# EAGLE board iMX233-OLinuXino-Micro_Rev_D (EAGLE 6.6.0), part 1 of 2
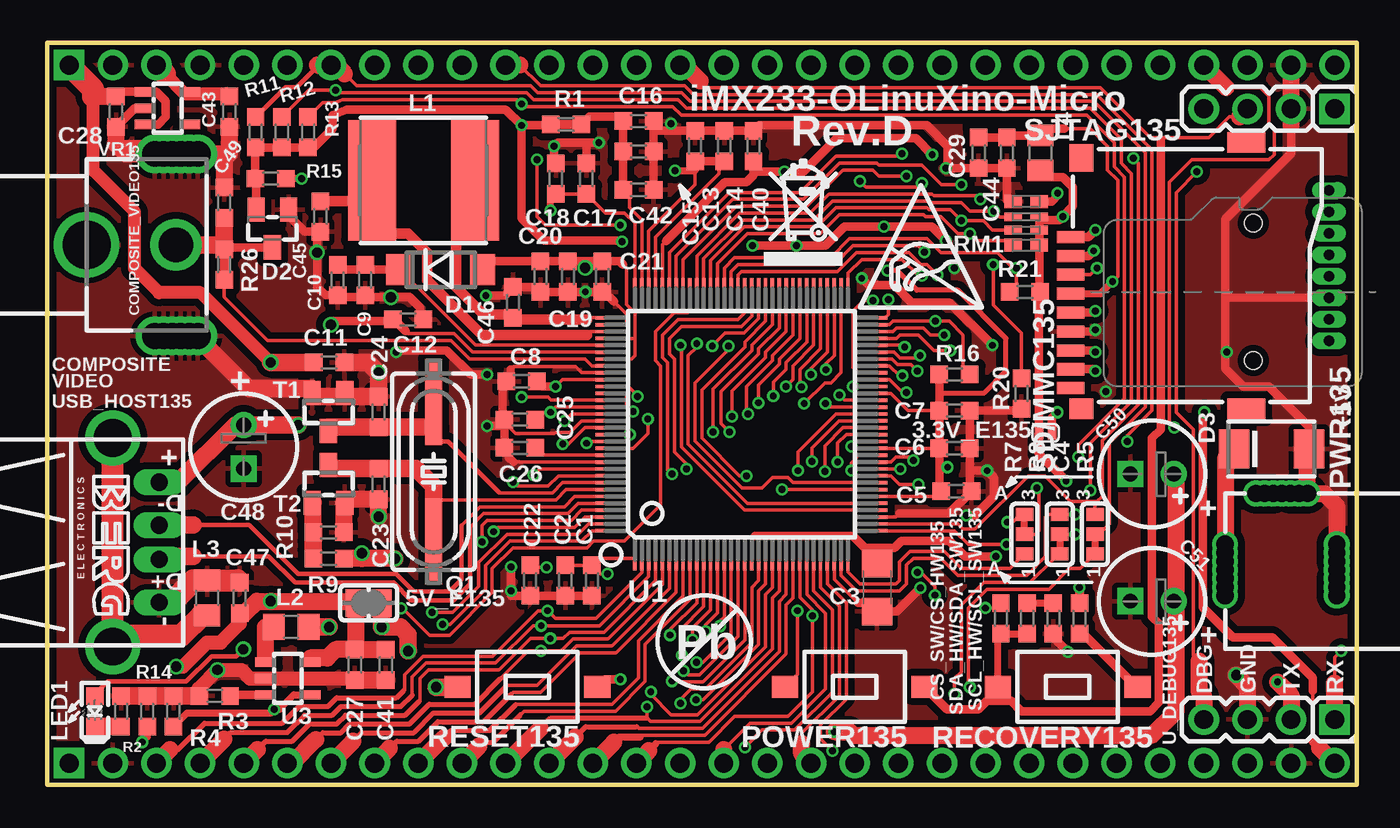
[diagram p2: board, top side]
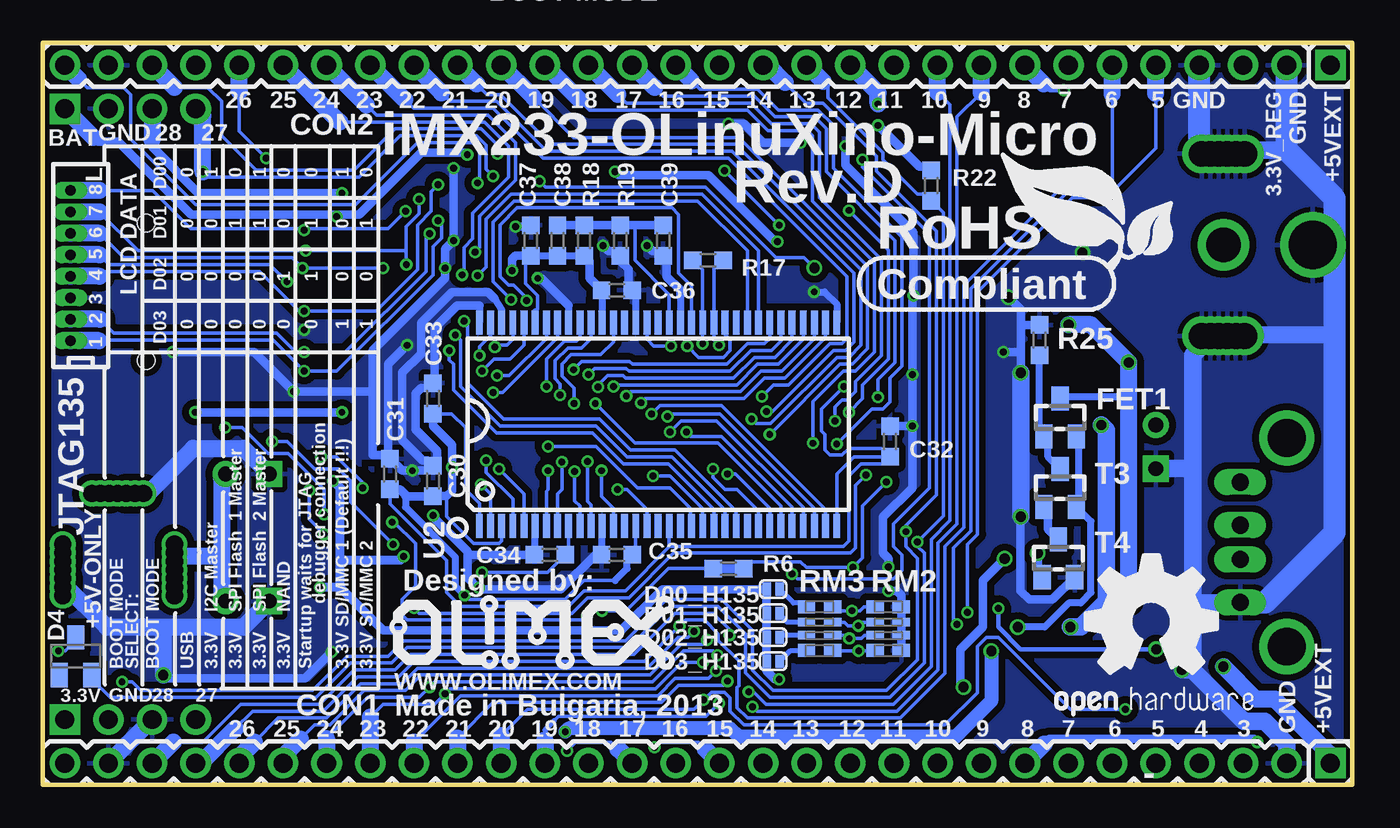
[diagram p3: board, bottom side, seen from below]

Size 76.2 x 43.2 mm. Coordinates in mm from the lower left corner, seen from the top.
Outline: 0,0 76.2,0 76.2,43.2 0,43.2 0,0
Copper layers (1+2*15+16): Top 0.035mm / dielectric 0.5mm / Route2 0.035mm / dielectric 0.5mm / Route15 0.035mm / dielectric 0.5mm / Bottom 0.035mm
Design rules "default": minimum track width 0.0051mm, minimum drill 0.3mm, track to track 0.15mm, track to pad 0.2mm, pad to pad 0.2mm, via to via 0.2mm, smd to smd 1mil, copper to edge 10mil, drill to drill 8mil, minimum pad ring 6mil, minimum via ring 0.15mm, stop-mask expansion 4mil, vias tented up to drill 25mil, thermal gap 12mil
Net classes: 1 PWR: width 0.203 mm, drill 0.4 mm, clearance 0.076 mm
tRestrict: 1 lines

## Footprints (pad centres in the part's own frame; a part is rotated, then mirrored left to right if it is on the bottom)
SJ_1_SMALLER = smd 0.508 x 0.762: 1 -0.381,0; 2 0.381,0
SJ-CLOSE = smd 1.168 x 1.6: 1 -0.762,0; 2 0.762,0
C0603_DWS = smd 1.016 x 1.016: 1 -0.889,0; 2 0.889,0
C1206 = smd 1.6 x 1.8: 1 -1.4,0; 2 1.4,0
E2,5-6,3 = drill 0.864 pad 1.524: + -1.27,0 | drill 0.864 pad 1.524 square: - 1.27,0
VIDEO_CINCH = drill 1.5 pad 1.93: GND1 -5.3,-5.475; GND1A -5.3,-3.975; GND1B -5.3,-4.475; GND1C -5.3,-4.975; GND1D -5.3,-5.975; GND1E -5.3,-6.475; GND3 5.3,-5.475; GND3C 5.3,-4.975; GND3D 5.3,-5.975; GND3E 5.3,-6.475; GNG3A 5.3,-3.975; GNG3B 5.3,-4.475 | drill 2.8: GND2 0,0 | drill 2: IO 0,-5.2
HN1X30 = drill 1.1 pad 1.778 square: 1 -36.83,0 | drill 1.1 pad 1.778: 2 -34.29,0; 3 -31.75,0; 4 -29.21,0; 5 -26.67,0; 6 -24.13,0; 7 -21.59,0; 8 -19.05,0; 9 -16.51,0; 10 -13.97,0; 11 -11.43,0; 12 -8.89,0; 13 -6.35,0; 14 -3.81,0; 15 -1.27,0; 16 1.27,0; 17 3.81,0; 18 6.35,0; 19 8.89,0; 20 11.43,0; 21 13.97,0; 22 16.51,0; 23 19.05,0; 24 21.59,0; 25 24.13,0; 26 26.67,0; 27 29.21,0; 28 31.75,0; 29 34.29,0; 30 36.83,0
SJ_2_SMALL = smd 0.762 x 1.016: 1 -1.143,0; 2 0,0; 3 1.143,0
MLL-41 = smd 1.45 x 1.8: A 2.445,0; K -2.445,0
SOT23C(BAT54S) = smd 1 x 1.4: 1 -0.95,-1.1; 2 0.95,-1.1; 3 0,1.1
DO214AA = smd 1.778 x 2.286: A 2.177,0; C -2.177,0
SOT23C = smd 1 x 1.4: 1 -0.95,-1.1; 2 0.95,-1.1; 3 0,1.1
SOT23 = smd 1 x 1.4: 1 -0.95,-1.1; 2 0.95,-1.1; 3 0,1.1
WU08S = drill 0.6 pad 0.991 long: 1 -4.375,0; 2 -3.125,0; 3 -1.875,0; 4 -0.625,0; 5 0.625,0; 6 1.875,0; 7 3.125,0; 8 4.375,0
L7078 = smd 2.8 x 7: 1 -3,0; 2 3,0
L0805_5MIL_DWS = smd 1.27 x 1.524: 1 -1.016,0; 2 1.016,0
LED-0603 = smd 1.016 x 1.016: A 0.889,0; C -0.889,0
SW-TAKT_6X3.5_SMD = smd 1.27 x 1.524: P$1 0,4.064; P$2 0,-4.064
PWR_JACK_UNI_MILLING = drill 1: + 0,4.75; +1 0,5.25; +2 0,5.75; +3 0,6.25; +4 0,4.25; +5 0,3.75; +6 0,3.25; - -6.5,4.75; -1 -6.5,5.25; -2 -6.5,5.75; -3 -6.5,4.25; -4 -6.5,3.75; -5 -6.5,6.25; -6 -6.5,3.25; -- -3.3,0.3; --1 -3.8,0.3; --2 -4.3,0.3; --3 -4.8,0.3; --4 -2.8,0.3; --5 -2.3,0.3; --6 -1.8,0.3
HC49/SMD2_THIN = smd 5 x 1: 1 -4.064,0; 2 4.064,0
0603_0R = smd 1.016 x 1.016: 1 -0.889,0; 2 0.889,0
R0603_5MIL_DWS = smd 1.016 x 1.016: 1 -0.889,0; 2 0.889,0
R_MATRIX_4 = smd 1.016 x 0.762: 1.1 -0.762,1.27; 1.2 0.762,1.27; 4.1 -0.762,-1.27; 4.2 0.762,-1.27 | smd 1.016 x 0.508: 2.1 -0.762,0.381; 2.2 0.762,0.381; 3.1 -0.762,-0.381; 3.2 0.762,-0.381
TFC-WPAPR-08 = smd 0.7 x 1.6: 1 -3.2,-0.125; 2 -2.1,-0.125; 3 -1,-0.125; 4 0.1,-0.125; 5 1.2,-0.125; 6 2.3,-0.125; 7 3.4,-0.125; 8 4.5,-0.125; 9 5.6,-0.125 | smd 1.2 x 1.4: 10 6.8,0.5 | smd 1.6 x 1.4: 11 -7.8,0.5 | smd 1.2 x 2.2: 12 6.8,10.1; 13 -8.7,10.1 | hole 1: 4,10.5; -4,10.5
HN1X4 = drill 1.1 pad 1.778 square: 1 -3.81,0 | drill 1.1 pad 1.778: 2 -1.27,0; 3 1.27,0; 4 3.81,0
SOT-23 = smd 1 x 1.4: 1 -0.95,-1.1; 2 0.95,-1.1; 3 0,1.1
TQFP128LD = smd 0.2 x 1.5: 1 -6.2,-7.75; 2 -5.8,-7.75; 3 -5.4,-7.75; 4 -5,-7.75; 5 -4.6,-7.75; 6 -4.2,-7.75; 7 -3.8,-7.75; 8 -3.4,-7.75; 9 -3,-7.75; 10 -2.6,-7.75; 11 -2.2,-7.75; 12 -1.8,-7.75; 13 -1.4,-7.75; 14 -1,-7.75; 15 -0.6,-7.75; 16 -0.2,-7.75; 17 0.2,-7.75; 18 0.6,-7.75; 19 1,-7.75; 20 1.4,-7.75; 21 1.8,-7.75; 22 2.2,-7.75; 23 2.6,-7.75; 24 3,-7.75; 25 3.4,-7.75; 26 3.8,-7.75; 27 4.2,-7.75; 28 4.6,-7.75; 29 5,-7.75; 30 5.4,-7.75; 31 5.8,-7.75; 32 6.2,-7.75; 65 6.2,7.75; 66 5.8,7.75; 67 5.4,7.75; 68 5,7.75; 69 4.6,7.75; 70 4.2,7.75; 71 3.8,7.75; 72 3.4,7.75; 73 3,7.75; 74 2.6,7.75; 75 2.2,7.75; 76 1.8,7.75; 77 1.4,7.75; 78 1,7.75; 79 0.6,7.75; 80 0.2,7.75; 81 -0.2,7.75; 82 -0.6,7.75; 83 -1,7.75; 84 -1.4,7.75; 85 -1.8,7.75; 86 -2.2,7.75; 87 -2.6,7.75; 88 -3,7.75; 89 -3.4,7.75; 90 -3.8,7.75; 91 -4.2,7.75; 92 -4.6,7.75; 93 -5,7.75; 94 -5.4,7.75; 95 -5.8,7.75; 96 -6.2,7.75 | smd 1.5 x 0.2: 33 7.75,-6.2; 34 7.75,-5.8; 35 7.75,-5.4; 36 7.75,-5; 37 7.75,-4.6; 38 7.75,-4.2; 39 7.75,-3.8; 40 7.75,-3.4; 41 7.75,-3; 42 7.75,-2.6; 43 7.75,-2.2; 44 7.75,-1.8; 45 7.75,-1.4; 46 7.75,-1; 47 7.75,-0.6; 48 7.75,-0.2; 49 7.75,0.2; 50 7.75,0.6; 51 7.75,1; 52 7.75,1.4; 53 7.75,1.8; 54 7.75,2.2; 55 7.75,2.6; 56 7.75,3; 57 7.75,3.4; 58 7.75,3.8; 59 7.75,4.2; 60 7.75,4.6; 61 7.75,5; 62 7.75,5.4; 63 7.75,5.8; 64 7.75,6.2; 97 -7.75,6.2; 98 -7.75,5.8; 99 -7.75,5.4; 100 -7.75,5; 101 -7.75,4.6; 102 -7.75,4.2; 103 -7.75,3.8; 104 -7.75,3.4; 105 -7.75,3; 106 -7.75,2.6; 107 -7.75,2.2; 108 -7.75,1.8; 109 -7.75,1.4; 110 -7.75,1; 111 -7.75,0.6; 112 -7.75,0.2; 113 -7.75,-0.2; 114 -7.75,-0.6; 115 -7.75,-1; 116 -7.75,-1.4; 117 -7.75,-1.8; 118 -7.75,-2.2; 119 -7.75,-2.6; 120 -7.75,-3; 121 -7.75,-3.4; 122 -7.75,-3.8; 123 -7.75,-4.2; 124 -7.75,-4.6; 125 -7.75,-5; 126 -7.75,-5.4; 127 -7.75,-5.8; 128 -7.75,-6.2
66TSOP-II = smd 0.4 x 1.4: 1 -10.4,-5.925; 2 -9.75,-5.925; 3 -9.1,-5.925; 4 -8.45,-5.925; 5 -7.8,-5.925; 6 -7.15,-5.925; 7 -6.5,-5.925; 8 -5.85,-5.925; 9 -5.2,-5.925; 10 -4.55,-5.925; 11 -3.9,-5.925; 12 -3.25,-5.925; 13 -2.6,-5.925; 14 -1.95,-5.925; 15 -1.3,-5.925; 16 -0.65,-5.925; 17 0,-5.925; 18 0.65,-5.925; 19 1.3,-5.925; 20 1.95,-5.925; 21 2.6,-5.925; 22 3.25,-5.925; 23 3.9,-5.925; 24 4.55,-5.925; 25 5.2,-5.925; 26 5.85,-5.925; 27 6.5,-5.925; 28 7.15,-5.925; 29 7.8,-5.925; 30 8.45,-5.925; 31 9.1,-5.925; 32 9.75,-5.925; 33 10.4,-5.925; 34 10.4,5.925; 35 9.75,5.925; 36 9.1,5.925; 37 8.45,5.925; 38 7.8,5.925; 39 7.15,5.925; 40 6.5,5.925; 41 5.85,5.925; 42 5.2,5.925; 43 4.55,5.925; 44 3.9,5.925; 45 3.25,5.925; 46 2.6,5.925; 47 1.95,5.925; 48 1.3,5.925; 49 0.65,5.925; 50 0,5.925; 51 -0.65,5.925; 52 -1.3,5.925; 53 -1.95,5.925; 54 -2.6,5.925; 55 -3.25,5.925; 56 -3.9,5.925; 57 -4.55,5.925; 58 -5.2,5.925; 59 -5.85,5.925; 60 -6.5,5.925; 61 -7.15,5.925; 62 -7.8,5.925; 63 -8.45,5.925; 64 -9.1,5.925; 65 -9.75,5.925; 66 -10.4,5.925
SOT23-5 = smd 0.55 x 1.2: 1 -0.95,-1.3; 2 0,-1.3; 3 0.95,-1.3; 4 0.95,1.3; 5 -0.95,1.3
USB_PN87520_HOST_PTH = drill 1 long: 1 -3.5,2.71; 2 -1,2.71; 3 1,2.71; 4 3.5,2.71 | drill 2.2: P$1 6.07,0; P$2 -6.07,0
SOT-23-5 = smd 0.55 x 1.2: 1 -0.95,-1.3; 2 0,-1.3; 3 0.95,-1.3; 4 0.95,1.3; 5 -0.95,1.3

## Placement (x,y rotation side)
3.3V_E135  Open  [SJ_1_SMALLER]  58.1,20.5 180 top
5V_E135  Close  [SJ-CLOSE]  18.7,10.6 180 top
C1  22uF/6.3V  [C0603_DWS]  31.7,11.9 90 top
C2  22uF/6.3V  [C0603_DWS]  30.15,11.9 90 top
C3  22uF/6.3V  [C1206]  48.3,11.5 90 top
C4  100nF  [C0603_DWS]  58.55,9.7 270 top
C5  4.7uF/6.3V  [C0603_DWS]  52.9,17.1 180 top
C6  100nF  [C0603_DWS]  52.8,19.6 180 top
C7  100nF  [C0603_DWS]  52.8,21.8 180 top
C8  4.7uF/6.3V  [C0603_DWS]  27.6,23.5 0 top
C9  22uF/6.3V  [C0603_DWS]  18.5,29.4 90 top
C10  22uF/6.3V  [C0603_DWS]  16.9,29.4 90 top
C11  22uF/6.3V  [C0603_DWS]  16.4,24.6 180 top
C12  100nF  [C0603_DWS]  21,27.1 180 top
C13  22uF/6.3V  [C0603_DWS]  37.7,37.2 270 top
C14  100nF  [C0603_DWS]  39.4,37.2 270 top
C15  22uF/6.3V  [C0603_DWS]  34.4,36.88 180 top
C16  100nF  [C0603_DWS]  34.4,38.65 180 top
C17  22uF/6.3V  [C0603_DWS]  31.38,35.3 270 top
C18  100nF  [C0603_DWS]  29.6,35.3 270 top
C19  22uF/6.3V  [C0603_DWS]  30.3,29.6 90 top
C20  22uF/6.3V  [C0603_DWS]  28.7,29.6 90 top
C21  22uF/6.3V  [C0603_DWS]  32.3,29.6 90 top
C22  100nF  [C0603_DWS]  28.1,11.9 90 top
C23  10pF  [C0603_DWS]  19.29,17.53 90 top
C24  10pF  [C0603_DWS]  19.29,21.72 270 top
C25  100nF  [C0603_DWS]  27.5,21.27 0 top
C26  1uF  [C0603_DWS]  27.5,19.62 0 top
C27  22uF/6.3V  [C0603_DWS]  17.9,7 270 top
C28  22uF/6.3V  [C0603_DWS]  4,39.2 270 top
C29  22uF/6.3V  [C0603_DWS]  54.2,36.8 90 top
C30  100nF  [C0603_DWS]  53.5,17.7 270 bottom
C31  100nF  [C0603_DWS]  56,18.1 270 bottom
C32  100nF  [C0603_DWS]  26.9,20 270 bottom
C33  100nF  [C0603_DWS]  53.5,22.5 270 bottom
C34  100nF  [C0603_DWS]  46.7,13.4 0 bottom
C35  100nF  [C0603_DWS]  42.8,13.4 0 bottom
C36  100nF  [C0603_DWS]  42.8,28.8 180 bottom
C37  100nF  [C0603_DWS]  47.8,31.7 270 bottom
C38  100nF  [C0603_DWS]  46.25,31.7 90 bottom
C39  100nF  [C0603_DWS]  40.1,31.7 90 bottom
C40  22uF/6.3V  [C0603_DWS]  41.1,37.2 270 top
C41  100nF  [C0603_DWS]  19.7,7 270 top
C42  22uF/6.3V  [C0603_DWS]  34.4,34.65 180 top
C43  22uF/6.3V  [C0603_DWS]  10.6,39.2 270 top
C44  22uF/6.3V  [C0603_DWS]  55.85,36.8 90 top
C45  20pF  [C0603_DWS]  15.9,33.1 90 top
C46  NA(10pF)  [C0603_DWS]  27.1,28.1 270 top
C47  22uF/6.3V  [C0603_DWS]  11.2,10.9 90 top
C48  100uF/16V/LOWESR/105C/6.3x11mm_RM2.5  [E2,5-6,3]  11.43,19.68 270 top
C49  47pF  [C0603_DWS]  10.3,33.9 90 top
C50  220uF/10V/105C  [E2,5-6,3]  64.3,18.1 180 top
C51  220uF/10V/105C  [E2,5-6,3]  64.3,10.7 180 top
COMPOSITE_VIDEO135  VIDEO_CON  [VIDEO_CINCH]  2.29,31.44 90 top
CON1  NA(HN1X30)  [HN1X30]  38.1,1.27 180 bottom
CON2  NA(HN1X30)  [HN1X30]  38.1,41.91 180 bottom
CS_SW/CS_HW135  CS_SW:Open/CS_HW:Close  [SJ_2_SMALL]  56.88,14.6 90 top
D00_H135  Close  [SJ_1_SMALLER]  33.7,11.4 180 bottom
D1  1N5819/SS14  [MLL-41]  22.9,30 0 top
D01_H135  Open  [SJ_1_SMALLER]  33.7,10 180 bottom
D2  BAT54S  [SOT23C(BAT54S)]  13.1,32.4 180 top
D02_H135  Open  [SJ_1_SMALLER]  33.7,8.6 180 bottom
D3  SMBJ6.0A  [DO214AA]  71.25,19.56 0 top
D03_H135  Close  [SJ_1_SMALLER]  33.7,7.2 180 bottom
D4  BAT54C  [SOT23C]  74.3,7.5 0 bottom
FET1  NA(IRLML6402)  [SOT23]  17,21.4 0 bottom
JTAG135  NA(WU08S)  [WU08S]  74.6,30.24 90 bottom
L1  22uH/1.5A/YS75/7x8mm  [L7078]  21.9,35.2 0 top
L2  FB0805/600R/2A  [L0805_5MIL_DWS]  14.2,9.2 180 top
L3  FB0805/600R/200mA(201209-601)  [L0805_5MIL_DWS]  9.3,10.9 270 top
L4  CL470nH/0805/1.76R/250mA  [L0805_5MIL_DWS]  57.8,36.8 90 top
LED1  GREEN(0603)  [LED-0603]  2.77,4.3 90 top
POWER135  T1107A(6x3,8x2,5mm)  [SW-TAKT_6X3.5_SMD]  46.99,5.71 90 top
PWR135  YDJ-1136  [PWR_JACK_UNI_MILLING]  68.55,17.27 180 top
Q1  Q24.000MHz/HC-49SM/SMD/20ppm/20pF  [HC49/SMD2_THIN]  22.48,18.24 270 top
R1  0R(Board_Mounted)  [0603_0R]  30.2,38.45 0 top
R2  2.2k  [R0603_5MIL_DWS]  4.29,4.3 270 top
R3  10k  [R0603_5MIL_DWS]  9.75,5.19 0 top
R4  10k  [R0603_5MIL_DWS]  7.34,4.3 270 top
R5  10k  [R0603_5MIL_DWS]  60.08,9.7 90 top
R6  0R(Board_Mounted)  [0603_0R]  36.3,12.6 0 bottom
R7  1k/1%  [R0603_5MIL_DWS]  55.5,9.7 270 top
R8  1k/1%  [R0603_5MIL_DWS]  57.02,9.7 270 top
R9  2.2k  [R0603_5MIL_DWS]  16.36,13.18 0 top
R10  2.2k  [R0603_5MIL_DWS]  16.36,14.71 0 top
R11  2.2k  [R0603_5MIL_DWS]  12.12,38 270 top
R12  2.2k  [R0603_5MIL_DWS]  13.65,38 270 top
R13  47k  [R0603_5MIL_DWS]  15.18,38 270 top
R14  NA(47k)  [R0603_5MIL_DWS]  5.82,4.3 270 top
R15  47k  [R0603_5MIL_DWS]  13,35.3 0 top
R16  10k  [R0603_5MIL_DWS]  52.8,23.9 180 top
R17  NA(120R)  [R0603_5MIL_DWS]  37.5,30.55 0 bottom
R18  1k/1%  [R0603_5MIL_DWS]  44.7,31.7 270 bottom
R19  1k/1%  [R0603_5MIL_DWS]  42.6,31.7 90 bottom
R20  1M  [R0603_5MIL_DWS]  56.7,22.8 270 top
R21  10k  [R0603_5MIL_DWS]  56.9,28.7 0 top
R22  4.7k  [R0603_5MIL_DWS]  24.5,34.9 270 bottom
R25  NA(47k)  [R0603_5MIL_DWS]  18.2,25.9 270 bottom
R26  0R(Board_Mounted)  [0603_0R]  10.3,30.3 90 top
RECOVERY135  T1107A(6x3,8x2,5mm)  [SW-TAKT_6X3.5_SMD]  59.39,5.71 270 top
RESET135  T1107A(6x3,8x2,5mm)  [SW-TAKT_6X3.5_SMD]  27.94,5.71 90 top
RM1  RA1206_(4X0603)_4B8_100K  [R_MATRIX_4]  56.97,32.69 0 top
RM2  RA1206_(4X0603)_4B8_47K  [R_MATRIX_4]  27,9.1 0 bottom
RM3  RA1206_(4X0603)_4B8_4.7K  [R_MATRIX_4]  31,9.1 0 bottom
SCL_HW/SCL_SW135  SCL_HW:Close/SCL_SW:Open  [SJ_2_SMALL]  60.98,14.6 90 top
SD/MMC135  MICRO_SD/MMC_CP_NEWTFC-WPAPR-08  [TFC-WPAPR-08]  59.69,28.7 270 top
SDA_HW/SDA_SW135  SDA_HW:Close/SDA_SW:Open  [SJ_2_SMALL]  58.92,14.6 90 top
SJTAG135  (NA)HN1X4  [HN1X4]  71.12,39.37 180 top
T1  BC846B  [SOT23]  16.36,21.72 180 top
T2  BC846B  [SOT23]  16.36,17.53 0 top
T3  NA(DTA114YKA)  [SOT-23]  17,17.3 0 bottom
T4  NA(DTC114YKA)  [SOT-23]  17.1,13.2 0 bottom
U1  MCIMX233CAG4C  [TQFP128LD]  40.4,21 0 top
U2  HY5DU121622D(L)T(P)-J  [66TSOP-II]  40.4,21 0 bottom
U3  SY6280  [SOT23-5]  14,6.2 270 top
U$5  [LOGO-OPENHARDWARE_8X8]  11.7,9.44 0 bottom
U$8  [OLIMEX1_V]  38.3,6.62 0 bottom
U$9  [PB]  38.24,8.34 0 top
U$10  [ESD_SYMBOL]  47.3,27.81 0 top
U$11  [RECYCLE_BIN1/8]  41.71,30.25 0 top
U$12  [ROHS]  27.7,28.3 0 bottom
U_DEBUG135  HN1X4  [HN1X4]  71.12,3.81 180 top
USB_HOST135  USB_A  [USB_PN87520_HOST_PTH]  3.81,14.13 270 top
VR1  AP1231-33  [SOT-23-5]  7,39.4 270 top